# Altium schematic sheet EleksTube_IPS_extend.SchDoc
size A4
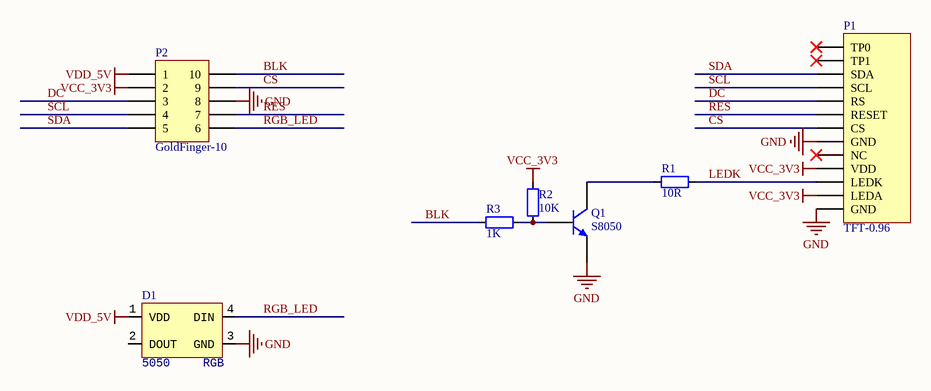
[diagram p0: EleksTube_IPS_extend.SchDoc]

## Parts
D1  Type: 5050  [LED_5050_WS2812B]  (hidden comment: RGB)
P1  TFT-0.96  [TFT-0.96]
P2  GoldFinger-10  [GoldFinger-10]
Q1  S8050  [SOT23-3]
R1  10R  [RES_0402]
R2  10K  [RES_0402]
R3  1K  [RES_0402]

## Nets
GND: D1.3(GND) P1.8(GND) P1.13(GND) P2.8 Q1.3(E)
VCC_3V3: P1.10(VDD) P1.12(LEDA) P2.2 R2.2
VDD_5V: D1.1(VDD) P2.1
BLK: P2.10 R3.1
CS: P1.7(CS) P2.9
DC: P1.5(RS) P2.3
LEDK: P1.11(LEDK) R1.2
RES: P1.6(RESET) P2.7
RGB_LED: D1.4(DIN) P2.6
SCL: P1.4(SCL) P2.4
SDA: P1.3(SDA) P2.5
NetQ1_1: Q1.1(C) R1.1
NetQ1_2: Q1.2(B) R2.1 R3.2

Not connected (* = marked no-connect by the designer): D1 2(DOUT); P1 1(TP0)* 2(TP1)* 9(NC)*

## Library data of the parts
D1 = LED_5050_WS2812B: LED; Value: RGB
P1 = Header 13: Header, 13-Pin; LatestRevisionDate: 17-Jul-2002; LatestRevisionNote: Re-released for DXP Platform.; Publisher: Altium Limited
P2 = GoldFinger-10: Header, 5-Pin, Dual row; LatestRevisionDate: 17-Jul-2002; LatestRevisionNote: Re-released for DXP Platform.; Publisher: Altium Limited
Q1 = NPN: NPN Bipolar Transistor; Published: 8-Jun-2000; LatestRevisionDate: 17-Jul-2002; LatestRevisionNote: Re-released for DXP Platform.; PackageReference: TO-226-AA; Publisher: Altium Limited; PackageDescription: TO, Flat Index; 3 In-Line, Axial Leads; Body Dia. 4.8mm; Leads 0.55 x 0.51 mm (max); Code_JEDEC: TO-226-AA
R1-R3 = 电阻-0402: Resistor; Value: 22R